# EAGLE design SOT-143_to_breadboard (EAGLE 8.5.1)
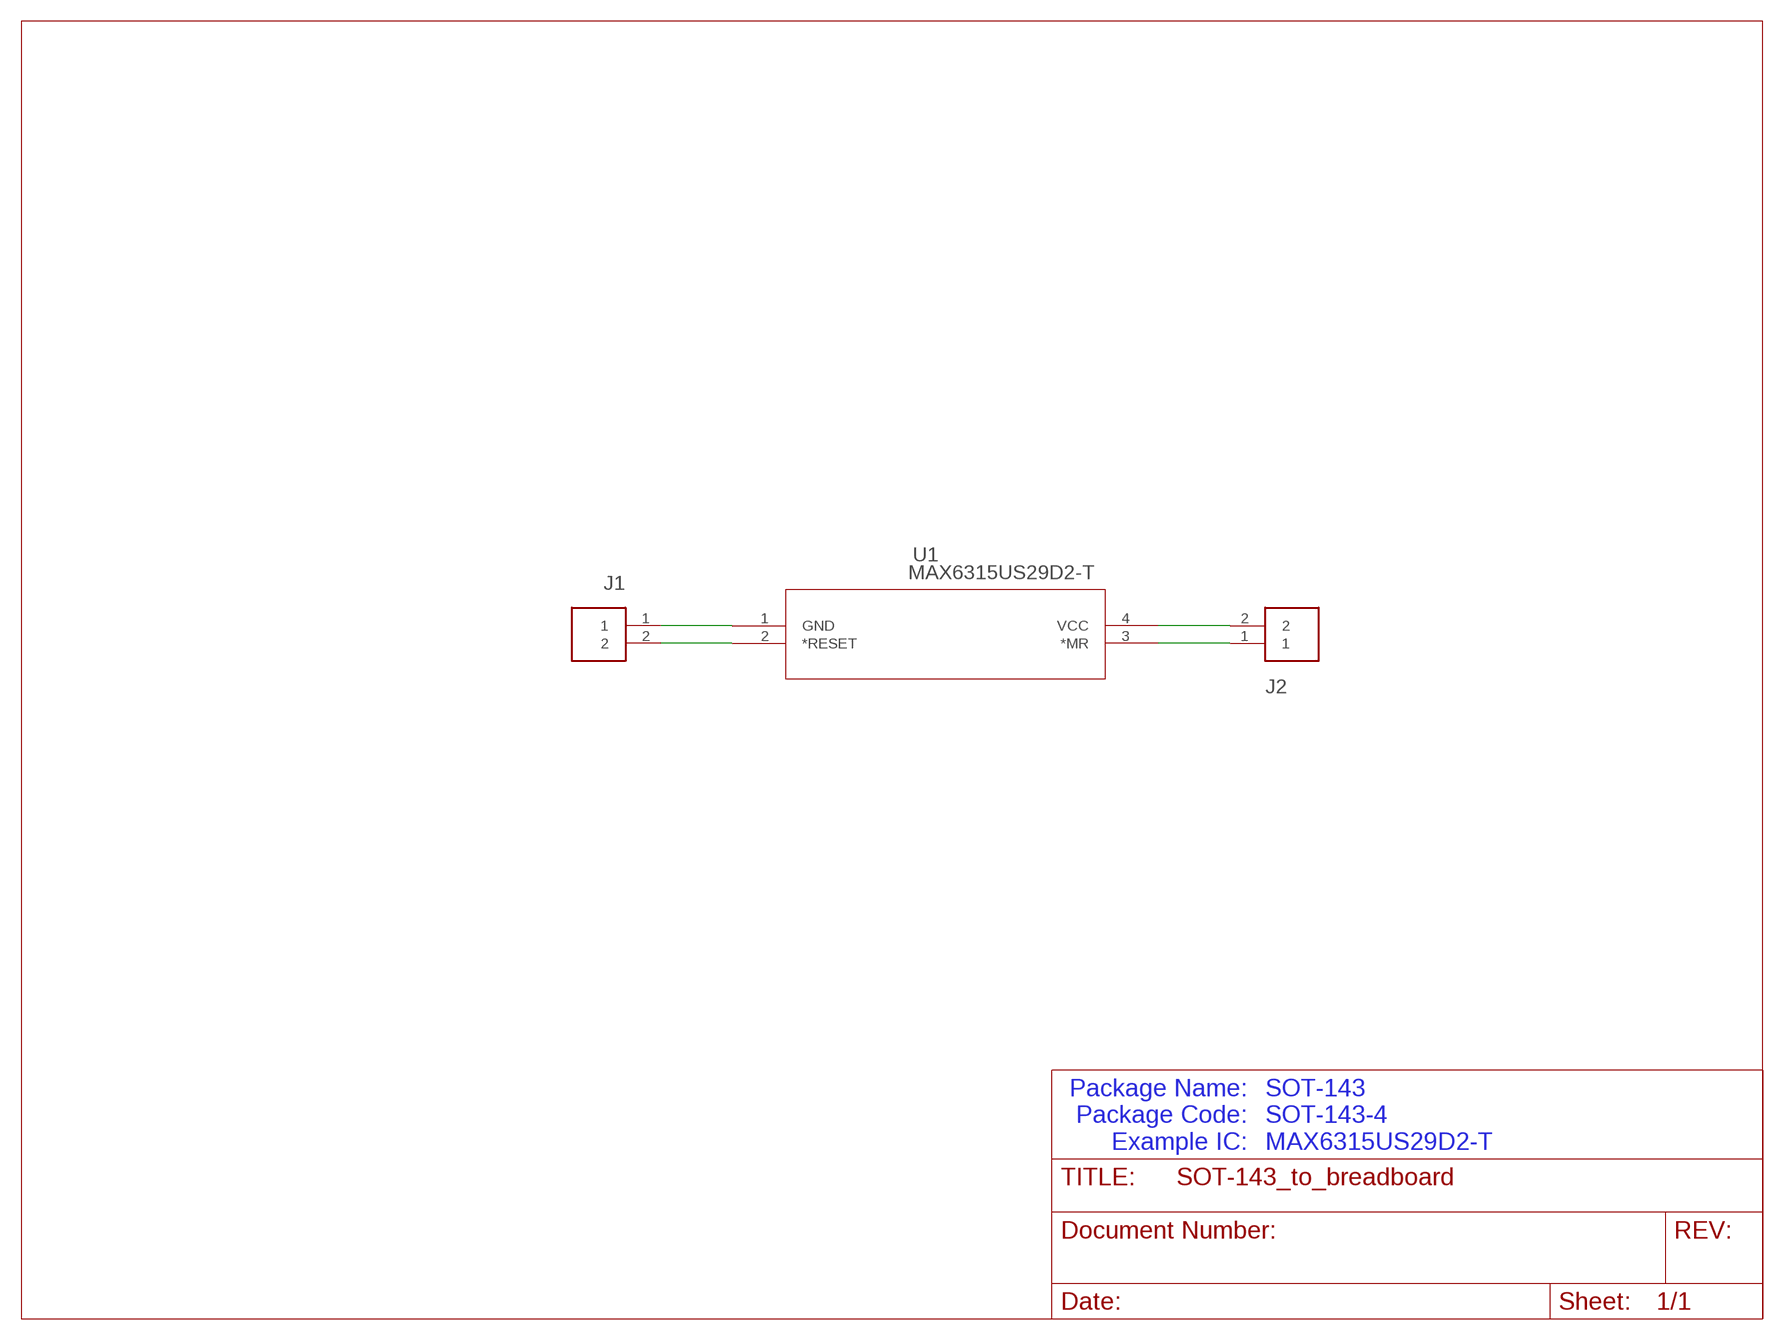
[diagram p0: schematic, sheet 1]

## Parts
J1  CONNECTOR_2  [68000-102HLF]
J2  CONNECTOR_2-NO_SQUARE  [68000-102HLF_NO_SQUARE]
U1  MAX6315US29D2-T  [21-0052F]

## Nets
N$1: J1.1 U1.1(GND)
N$2: J1.2 U1.2(*RESET)
N$3: J2.1 U1.3(*MR)
N$4: J2.2 U1.4(VCC)

## Notes on the sheet
- Package Name:
  Package Code:
  Example IC:
- SOT-143
  SOT-143-4
  MAX6315US29D2-T

## Library data of the parts
J1 J2 = SnapEDA:CONNECTOR_2
U1 = SnapEDA:MAX6315US29D2-T; AVAILABILITY: Good; DESCRIPTION: Processor Supervisor 2.93V 1V to 5.5V 4-Pin_3+Tab_ SOT-143 T/R; MF: Maxim Integrated; MP: MAX6315US29D2+T; PACKAGE: SOT-143 Maxim Integrated; PRICE: 3.02 USD

## Board
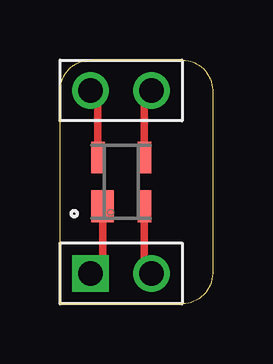
[diagram p1: board, top side]
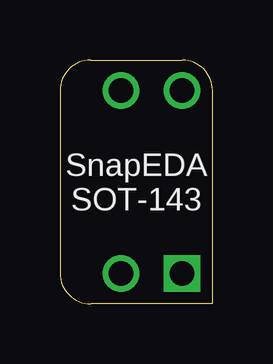
[diagram p2: board, bottom side, seen from below]

Size 6.36 x 10.16 mm. Coordinates in mm from the lower left corner, seen from the top.
Outline: 1.3,10.16 5.09,10.16 arc-90 6.36,8.89 arc0 6.36,1.27 arc-90 5.09,0
Outline: 5.07,0 0.01,0 arc0 0.01,8.89 arc-90 1.28,10.16
Copper layers (1*16): Top 0.035559375mm / dielectric 1.6mm / Bottom 0.035559375mm
Design rules "oshpark-2layer": minimum track width 6mil, minimum drill 10mil, track to track 6mil, track to pad 6mil, pad to pad 6mil, via to via 6mil, smd to smd 6mil, copper to edge 15mil, drill to drill 6mil, minimum pad ring 5mil, minimum via ring 5mil, stop-mask expansion 2.5mil, vias tented up to drill 0mil, thermal gap 10mil

### Footprints (pad centres in the part's own frame; a part is rotated, then mirrored left to right if it is on the bottom)
68000-102HLF = drill 1.016 square: 1 0,0 | drill 1.016: 2 2.54,0
68000-102HLF_NO_SQUARE = drill 1.016: 1 0,0; 2 2.54,0
21-0052F = smd 0.94 x 1.321: 1 -0.775,-1.016 | smd 0.559 x 1.321: 2 0.965,-1.016; 3 0.965,1.016; 4 -0.965,1.016

### Placement (x,y rotation side)
J1  1.28,1.27 0 top
J2  3.82,8.89 180 top
U1  2.55,5.08 0 top

### Tracks (layer width: path | path; a pad name or v marks a point on that pad's centre or on a via)
N$1
  Top 0.305: U1.1 1.77,1.76 J1.1
N$2
  Top 0.305: U1.2 3.51,1.57 J1.2
N$3
  Top 0.305: U1.3 3.51,8.59 J2.1
N$4
  Top 0.305: U1.4 1.58,8.59 J2.2

### Text on the board
bPlace: SnapEDA / SOT-143